# EAGLE schematic mcp23008 (EAGLE 6.4)
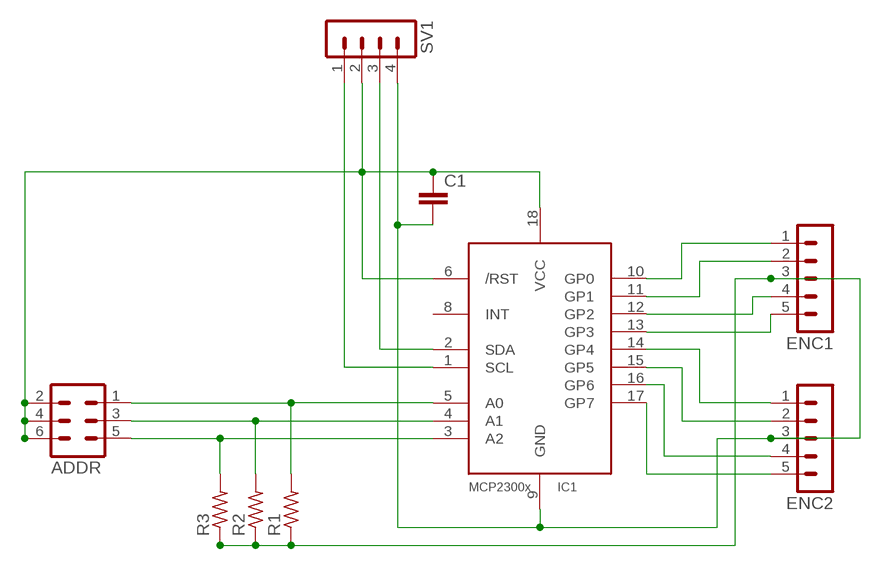
[diagram p0: schematic, sheet 1]

## Parts
ADDR  MA03-2  [MA03-2]
C1  C2.5/2  [C2.5-2]
ENC1  MA05-1  [MA05-1]
ENC2  MA05-1  [MA05-1]
IC1  MCP2300X/P  [DIL18]
R1  R-US_0204/7  [0204/7]
R2  R-US_0204/7  [0204/7]
R3  R-US_0204/7  [0204/7]
SV1  MA04-1  [MA04-1]

## Nets
N$1: IC1.1(SCL) SV1.1
N$2: ADDR.2 ADDR.4 ADDR.6 C1.1 IC1.6(/RST) IC1.18(VCC) SV1.2
N$3: ENC2.5 IC1.17(GP7)
N$4: ADDR.1 IC1.5(A0) R1.2
N$5: ADDR.3 IC1.4(A1) R2.2
N$6: ADDR.5 IC1.3(A2) R3.2
N$7: IC1.2(SDA) SV1.3
N$8: ENC2.4 IC1.16(GP6)
N$10: ENC2.2 IC1.15(GP5)
N$11: ENC2.1 IC1.14(GP4)
N$12: ENC1.4 IC1.12(GP2)
N$13: ENC1.2 IC1.11(GP1)
N$14: ENC1.1 IC1.10(GP0)
N$15: ENC1.5 IC1.13(GP3)
N$17: C1.2 ENC1.3 ENC2.3 IC1.9(GND) R1.1 R2.1 R3.1 SV1.4
Unconnected: IC1.8(INT)

## Library data of the parts
ADDR = con-lstb:MA03-2: PIN HEADER; OC_FARNELL: unknown; OC_NEWARK: unknown
C1 = capacitor-wima:C: CAPACITOR naming: grid - package width
ENC1 ENC2 = con-lstb:MA05-1: PIN HEADER; OC_FARNELL: unknown; OC_NEWARK: unknown
IC1 = adafruit:MCP2300X: MCP23008 Inexpensive i2c i/o expander - 8 general purpose i/o pins with optional pullups
R1-R3 = resistor:R-US_: RESISTOR, American symbol
SV1 = con-lstb:MA04-1: PIN HEADER; OC_FARNELL: unknown; OC_NEWARK: unknown